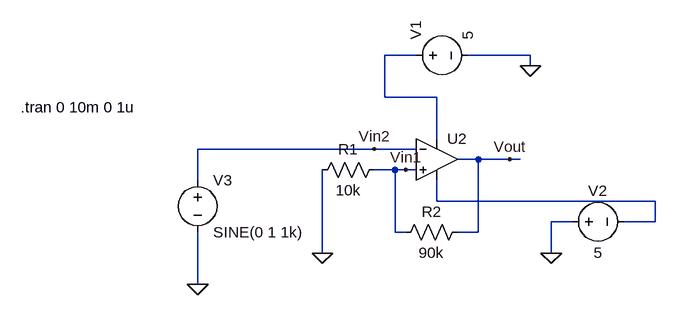
[diagram p0: schematic comparador.asc]
comparador.asc, the LTspice schematic file:
Version 4.1
SHEET 1 880 680
WIRE 192 0 144 0
WIRE 368 0 272 0
WIRE 368 16 368 0
WIRE 144 64 144 0
WIRE 224 64 144 64
WIRE 224 128 224 64
WIRE 128 144 -144 144
WIRE 192 144 128 144
WIRE 288 160 256 160
WIRE 336 160 288 160
WIRE 352 160 336 160
WIRE 160 176 128 176
WIRE 176 176 160 176
WIRE 192 176 176 176
WIRE -144 192 -144 144
WIRE 224 224 224 192
WIRE 560 224 224 224
WIRE 432 256 400 256
WIRE 560 256 560 224
WIRE 560 256 512 256
WIRE 160 272 160 176
WIRE 176 272 160 272
WIRE 288 272 288 160
WIRE 288 272 256 272
WIRE 48 304 48 176
WIRE 400 304 400 256
WIRE -144 352 -144 272
FLAG 48 304 0
FLAG 368 16 0
FLAG 128 144 Vin2
FLAG 176 176 Vin1
FLAG 336 160 Vout
FLAG 400 304 0
FLAG -144 352 0
SYMBOL res 144 160 R90
WINDOW 0 0 56 VBottom 2
WINDOW 3 32 56 VTop 2
SYMATTR InstName R1
SYMATTR Value 10k
SYMBOL res 272 256 R90
WINDOW 0 0 56 VBottom 2
WINDOW 3 32 56 VTop 2
SYMATTR InstName R2
SYMATTR Value 90k
SYMBOL voltage 176 0 R270
WINDOW 123 0 0 Left 0
WINDOW 39 0 0 Left 0
SYMATTR InstName V1
SYMATTR Value 5
SYMBOL voltage 416 256 R270
WINDOW 0 32 56 VTop 2
WINDOW 3 -32 56 VBottom 2
WINDOW 123 0 0 Left 0
WINDOW 39 0 0 Left 0
SYMATTR InstName V2
SYMATTR Value 5
SYMBOL voltage -144 176 R0
WINDOW 123 0 0 Left 0
WINDOW 39 0 0 Left 0
SYMATTR InstName V3
SYMATTR Value SINE(0 1 1k)
SYMBOL OpAmps\\UniversalOpAmp2 224 160 R0
SYMATTR InstName U2
TEXT -416 80 Left 2 !.tran 0 10m 0 1u

The netlist it stands for:
* comparador.asc
R1 Vin1 0 10k
R2 Vout Vin1 90k
V1 N001 0 5
V2 0 N002 5
V3 Vin2 0 SINE(0 1 1k)
X§U2 Vin1 Vin2 N001 N002 Vout level2 Avol=1Meg GBW=10Meg Slew=10Meg Ilimit=25m Rail=0 Vos=0 En=0 Enk=0 In=0 Ink=0 Rin=500Meg  ; pins In+ In- V+ V- OUT
.tran 0 10m 0 1u
.lib UniversalOpAmp2.lib
.backanno
.end